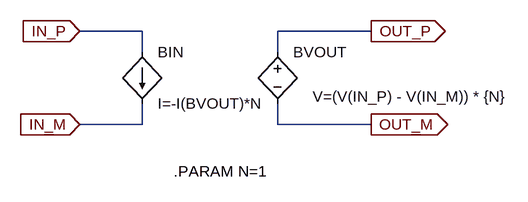
[diagram p0: schematic transformer.asc]
transformer.asc, the LTspice schematic file:
Version 4
SHEET 1 1128 680
WIRE -32 208 -128 208
WIRE 320 208 176 208
WIRE -32 240 -32 208
WIRE 176 240 176 208
WIRE -32 352 -32 320
WIRE -32 352 -128 352
WIRE 176 352 176 320
WIRE 320 352 176 352
FLAG -128 208 IN_P
IOPIN -128 208 In
FLAG -128 352 IN_M
IOPIN -128 352 In
FLAG 320 208 OUT_P
IOPIN 320 208 Out
FLAG 320 352 OUT_M
IOPIN 320 352 Out
SYMBOL bv 176 224 R0
WINDOW 3 54 85 Left 2
SYMATTR Value V=(V(IN_P) - V(IN_M)) * {N}
SYMATTR InstName BVOUT
SYMBOL bi -32 240 R0
SYMATTR InstName BIN
SYMATTR Value I=-I(BVOUT)*N
TEXT 16 424 Left 2 !.PARAM N=1

The netlist it stands for:
* transformer.asc
BVOUT OUT_P OUT_M V=(V(IN_P) - V(IN_M)) * {N}
BIN IN_P IN_M I=-I(BVOUT)*N
.PARAM N=1
.backanno
.end